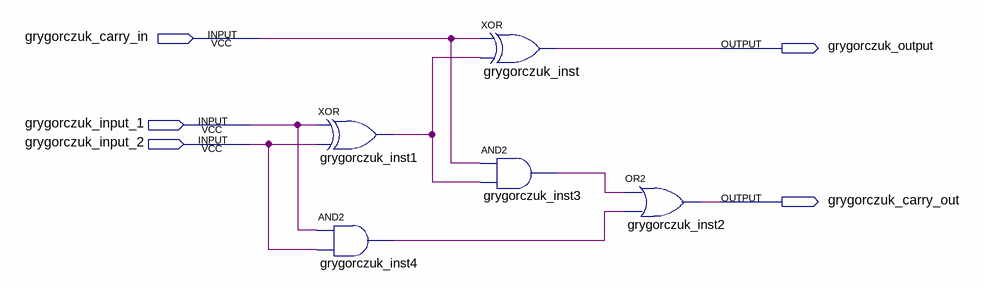
[diagram p0: schematic sheet]
// Quartus schematic FULL_ADDER_GATES.bdf as structural Verilog: 5 symbols, 5 pins
module FULL_ADDER_GATES (
  input  grygorczuk_carry_in,
  input  grygorczuk_input_1,
  input  grygorczuk_input_2,
  output grygorczuk_output,
  output grygorczuk_carry_out
);

  wire grygorczuk_inst1_out, grygorczuk_inst3_out, grygorczuk_inst4_out;

  xor grygorczuk_inst1 (grygorczuk_inst1_out, grygorczuk_input_1, grygorczuk_input_2);
  and grygorczuk_inst4 (grygorczuk_inst4_out, grygorczuk_input_1, grygorczuk_input_2);
  xor grygorczuk_inst (grygorczuk_output, grygorczuk_carry_in, grygorczuk_inst1_out);
  and grygorczuk_inst3 (grygorczuk_inst3_out, grygorczuk_carry_in, grygorczuk_inst1_out);
  or grygorczuk_inst2 (grygorczuk_carry_out, grygorczuk_inst3_out, grygorczuk_inst4_out);
endmodule
